# Altium schematic sheet RandomNumberCircuit.SchDoc
size A4; SheetNumber: 1; SheetTotal: 1
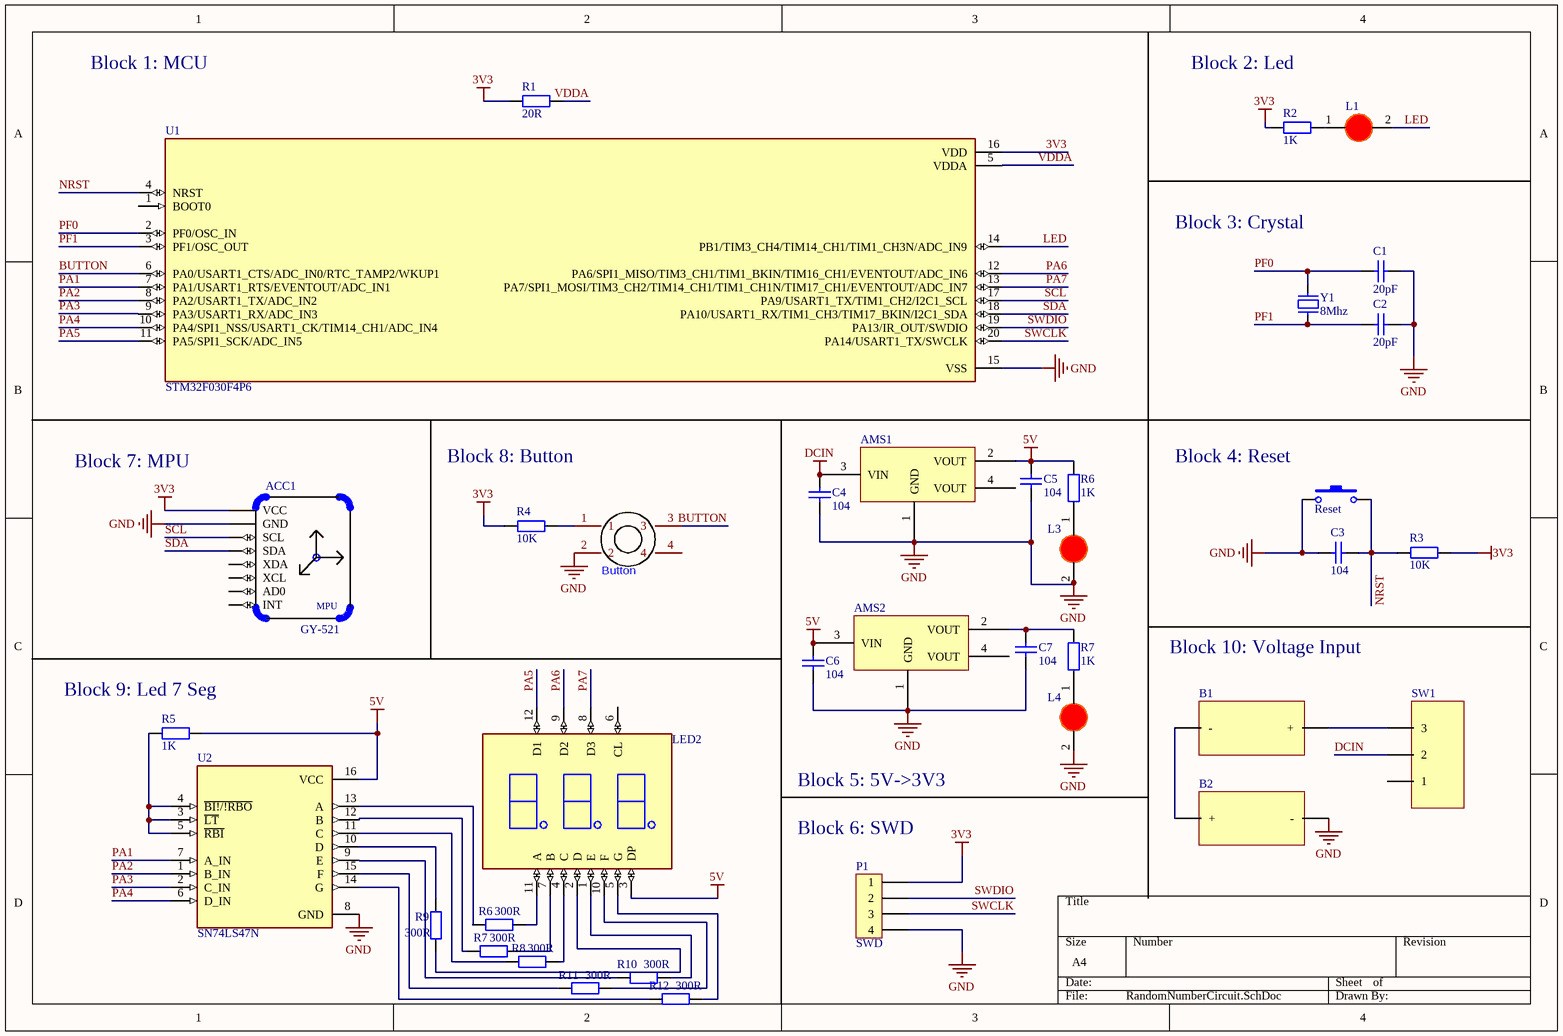
[diagram p0: RandomNumberCircuit.SchDoc]

## Parts
(Parts that share a designator on the sheet are numbered #1, #2 ... from top to bottom, then left to right.)
ACC1  GY-521  [*GY-521_GY-521(Primary)]
AMS1  AMS1117-5V  [SOT223]  (value not drawn)
AMS2  AMS1117-3.3V  [SOT223]  (value not drawn)
B1  (no value)  [16340base]
B2  (no value)  [16340base]
Button  Nut Nhan 4 chan 12x12  [12X12 BUTTOM Blue]  (value not drawn)
C1  20pF  [tu 1206]
C2  20pF  [tu 1206]
C3  104  [tu 1206]
C4  104  [tu 1206]
C5  104  [tu 1206]
C6  104  [tu 1206]
C7  104  [tu 1206]
L1  (no value)  [LED-1206-Red]
L3  (no value)  [LED-1206-Red]
L4  (no value)  [LED-1206-Red]
LED2  (no value)  [LED-3DIGIT]
P1  SWD  [header4p_90]
R1  20R  [tro smd 1206]
R2  1K  [tro smd 1206]
R3  10K  [tro smd 1206]
R4  10K  [tro smd 1206]
R5  1K  [tro smd 1206]
R6#1  1K  [tro smd 1206]
R6#2  300R  [tro smd 1206]
R7#1  1K  [tro smd 1206]
R7#2  300R  [tro smd 1206]
R8  300R  [tro smd 1206]
R9  300R  [tro smd 1206]
R10  300R  [tro smd 1206]
R11  300R  [tro smd 1206]
R12  300R  [tro smd 1206]
Reset  Nut Nhan 2 Chan SMD 3x6x2.5  [Nut Nhan 2 Chan SMD 3x6x2.5]  (value not drawn)
SW1  (no value)  [slidingswitch]
U1  STM32F030F4P6  [SOP65P640X120-20N]
U2  SN74LS47N  [DIP794W45P254L1930H508Q16]
Y1  8Mhz  [Thach Anh 2 chan SMD]

## Nets
3V3: ACC1.VCC P1.1 R1.1 R2.1 R3.2 R4.1 U1.16(VDD)
5V: AMS1.2(VOUT) AMS2.3(VIN) C5.1 C6.1 LED2.3(DP) R5.2 R6#1.2 U2.16(VCC)
DCIN: AMS1.3(VIN) C4.1 SW1.2
GND: ACC1.GND AMS1.1(GND) AMS2.1(GND) B2.2(-) Button.2 C1.1 C2.1 C3.2 C4.2 C5.2 C6.2 C7.2 L3.2(K) L4.2(K) P1.4 Reset.1 U1.15(VSS) U2.8(GND)
BUTTON: Button.3 U1.6(PA0/USART1_CTS/ADC_IN0/RTC_TAMP2/WKUP1)
LED: L1.2(K) U1.14(PB1/TIM3_CH4/TIM14_CH1/TIM1_CH3N/ADC_IN9)
NRST: C3.1 R3.1 Reset.2 U1.4(NRST)
PA1: U1.7(PA1/USART1_RTS/EVENTOUT/ADC_IN1) U2.7(A_IN)
PA2: U1.8(PA2/USART1_TX/ADC_IN2) U2.1(B_IN)
PA3: U1.9(PA3/USART1_RX/ADC_IN3) U2.2(C_IN)
PA4: U1.10(PA4/SPI1_NSS/USART1_CK/TIM14_CH1/ADC_IN4) U2.6(D_IN)
PA5: LED2.12(D1) U1.11(PA5/SPI1_SCK/ADC_IN5)
PA6: LED2.9(D2) U1.12(PA6/SPI1_MISO/TIM3_CH1/TIM1_BKIN/TIM16_CH1/EVENTOUT/ADC_IN6)
PA7: LED2.8(D3) U1.13(PA7/SPI1_MOSI/TIM3_CH2/TIM14_CH1/TIM1_CH1N/TIM17_CH1/EVENTOUT/ADC_IN7)
PF0: C1.2 U1.2(PF0/OSC_IN) Y1.2
PF1: C2.2 U1.3(PF1/OSC_OUT) Y1.1
SCL: ACC1.SCL U1.17(PA9/USART1_TX/TIM1_CH2/I2C1_SCL)
SDA: ACC1.SDA U1.18(PA10/USART1_RX/TIM1_CH3/TIM17_BKIN/I2C1_SDA)
SWCLK: P1.3 U1.20(PA14/USART1_TX/SWCLK)
SWDIO: P1.2 U1.19(PA13/IR_OUT/SWDIO)
VDDA: R1.2 U1.5(VDDA)
NetAMS2_2: AMS2.2(VOUT) C7.1 R7#1.2
NetB1_1: B1.1(+) SW1.3
NetB1_2: B1.2(-) B2.1(+)
NetButton_1: Button.1 R4.2
NetL1_1: L1.1(A) R2.2
NetL3_1: L3.1(A) R6#1.1
NetL4_1: L4.1(A) R7#1.1
NetLED2_1: LED2.1(E) R10.2
NetLED2_2: LED2.2(D) R9.1
NetLED2_4: LED2.4(C) R8.2
NetLED2_5: LED2.5(G) R12.2
NetLED2_7: LED2.7(B) R7#2.2
NetLED2_10: LED2.10(F) R11.2
NetLED2_11: LED2.11(A) R6#2.2
NetR5_1: R5.1 U2.3(~{LT}) U2.4(~{BI!/!RBO}) U2.5(~{RBI})
NetR6#2_1: R6#2.1 U2.13(A)
NetR7#2_1: R7#2.1 U2.12(B)
NetR8_1: R8.1 U2.11(C)
NetR9_2: R9.2 U2.10(D)
NetR10_1: R10.1 U2.9(E)
NetR11_1: R11.1 U2.15(F)
NetR12_1: R12.1 U2.14(G)

Not connected (* = marked no-connect by the designer): ACC1 AD0 INT XCL XDA; AMS1 4(VOUT); AMS2 4(VOUT); Button 4; LED2 6(CL); SW1 1; U1 1(BOOT0)

## Notes on the sheet
- Block 1: MCU
- Block 2: Led
- Block 3: Crystal
- Block 7: MPU
- Block 8: Button
- (near Reset) Block 4: Reset
- Block 10: Voltage Input
- (near R5) Block 9: Led 7 Seg
- Block 5: 5V->3V3
- (near P1) Block 6: SWD
- (in symbol GY-521) MPU

## Library data of the parts
ACC1 = GY-521: Triple Axis Accelerometer Gyro Breakout; MF: GODREAM FORDREAM CO., LIMITED; SnapEDA_Link: https://www.snapeda.com/parts/GY-521/GODREAM+FORDREAM+CO.%252C+LIMITED/view-part/?ref=snap; Package: Package; MP: GY-521; Check_prices: https://www.snapeda.com/parts/GY-521/GODREAM+FORDREAM+CO.%252C+LIMITED/view-part/?ref=eda; Value: *
AMS1 AMS2 = AMS1117 SMD: Dán; Value: AMS1117-3.3V SOT223; Don_Vi: Con; Ma_Hang: MH000596; Ghi_Chu: *; Kieu_Chan: *; Chung_Loai: Dán
B1 B2 = 16340base
C1-C3 = Tu 1206 105 50V 20%: Dán; Don_Vi: Con; So_Chan: 2; Ten_Linh_Kien: Tụ 1206 105-1uF 20% 50V; Ma_Hang: MH004545; Chung_Loai: Dán; Kieu_Chan: *
C4-C7 = Tu 1206 104 50V 20%: Dán; Don_Vi: Con; So_Chan: 2; Ten_Linh_Kien: Tụ 1206 104-0.1uF 20% 50V; Ma_Hang: MH004544; Chung_Loai: Dán; Kieu_Chan: *
L1 L3 L4 = LED 1206 Do: Dán; Don_Vi: Con; Ma_Hang: MH002334; Ten_Linh_Kien: LED1206 Màu Đỏ (Red); Ghi_Chu: *; Kieu_Chan: *; Chung_Loai: Dán
LED2 = LTC-4624JR: Display Modules - LED Character and Numeric Red 7-Segment 3 Character Common Anode 2V 20mA 0.504 H x 1.182 W x 0.276 D (12.80mm x 30.02mm x 7.00mm) 16-DIP; MF: Lite-On Inc.; SnapEDA_Link: https://www.snapeda.com/parts/LTC-4624JR/Lite-On+Inc./view-part/?ref=snap; Package: None; Value: *; MP: LTC-4624JR; Check_prices: https://www.snapeda.com/parts/LTC-4624JR/Lite-On+Inc./view-part/?ref=eda
P1 = header4p_90
R1-R5 R6#1 R7#1 = Tro 1206 1% 1k: Dán; Don_Vi: Con; So_Chan: 2; Ten_Linh_Kien: Trở 1206 1% 1k; Ma_Hang: MH005880; Chung_Loai: Dán; Kieu_Chan: *
R6#2 R7#2 R8-R12 = Tro 1206 5% 300R: Dán; Don_Vi: Con; So_Chan: 2; Ten_Linh_Kien: Trở 1206 5% 300R; Ma_Hang: MH005926; Chung_Loai: Dán; Kieu_Chan: *
Reset = Nut Nhan 2 Chan SMD 3x6x2.5: Ma_Hang: MH001036; Ten: Nút Nhấn 2 Chân 3x6x2.5MM SMD
SW1 = slidingswitch
U1 = STM32F030F4P6: MCU 32-bit STM32F ARM Cortex M0 RISC 16KB Flash 2.5V/3.3V 20-Pin TSSOP Tray; Value: *; Availability: Unavailable; Price: None; MP: STM32F030F4P6; Package: None
U2 = SN74LS47N: BCD-to-Seven-Segment Decoders/Drivers 16-PDIP 0 to 70; MF: Texas Instruments; SnapEDA_Link: https://www.snapeda.com/parts/SN74LS47N/Texas+Instruments/view-part/?ref=snap; MP: SN74LS47N; Availability: In Stock; Price: None; Check_prices: https://www.snapeda.com/parts/SN74LS47N/Texas+Instruments/view-part/?ref=eda; Value: *; Purchase-URL: https://pricing.snapeda.com/search/part/SN74LS47N/?ref=eda; Package: PDIP-16 Texas Instruments
Y1 = Thach Anh 2 chan SMD: Crystal For all Crystal 2pin.; Value: 4Mhz